# EAGLE schematic SwimWatch2.1 (EAGLE 6.6.0)
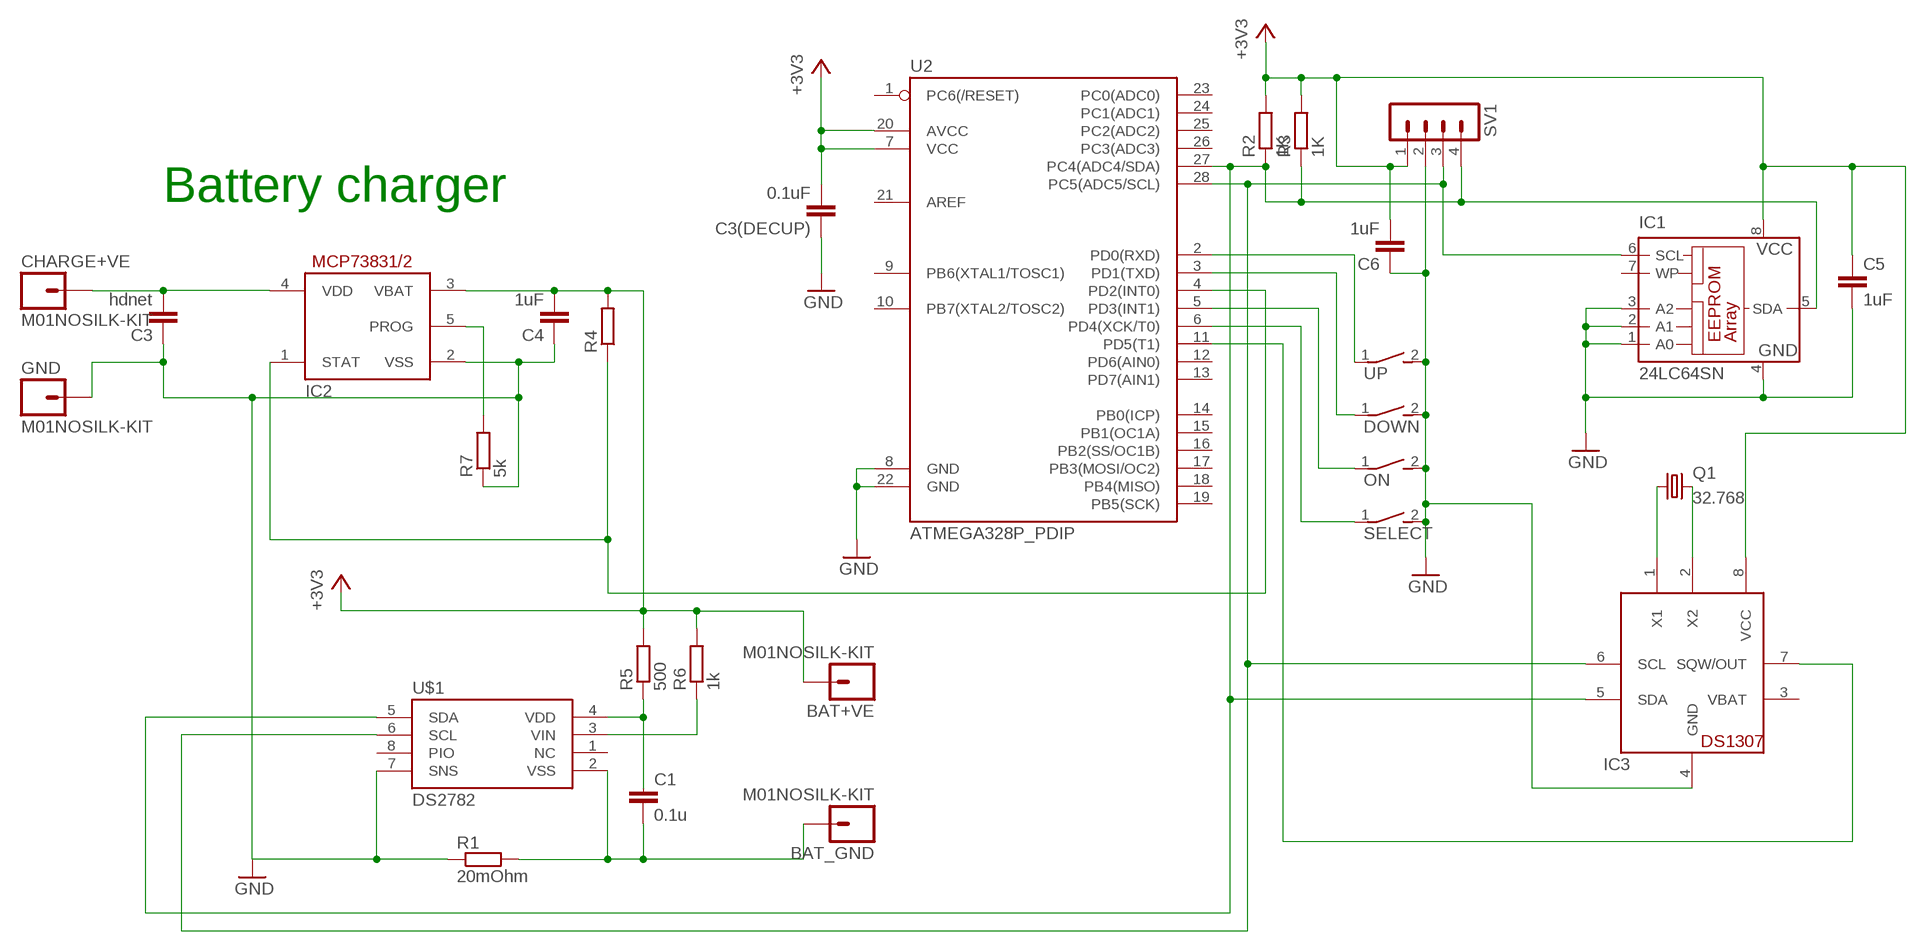
[diagram p0: schematic, sheet 1]

## Parts
BAT+VE  M01NOSILK-KIT  [1X01NS-KIT]
BAT_GND  M01NOSILK-KIT  [1X01NS-KIT]
C1  0.1u  C-EU025-030X050  [C025-030X050]
C3  hdnet  C-EUC0805  [C0805]
C3(DECUP)  0.1uF  C-EUC0805  [C0805]
C4  1uF  C-EUC0805  [C0805]
C5  1uF  C-EUC0805  [C0805]
C6  1uF  C-EUC0805  [C0805]
CHARGE+VE  M01NOSILK-KIT  [1X01NS-KIT]
DOWN  DS01E  [DS-01]
GND  M01NOSILK-KIT  [1X01NS-KIT]
IC1  24LC64SN  [SO-08]
IC2  MCP73831/OT  [SOT23-5L]
IC3  DS1307  [DIL08]
ON  DS01E  [DS-01]
Q1  32.768  CRYSTALHC18U-V  [HC18U-V]
R1  20mOhm  R-EU_0204/5  [0204/5]
R2  1K  R-EU_M0805  [M0805]
R3  1K  R-EU_M0805  [M0805]
R4  R-EU_0204/5  [0204/5]
R5  500  R-EU_0204/5  [0204/5]
R6  1k  R-EU_0204/5  [0204/5]
R7  5k  R-EU_0204/5  [0204/5]
SELECT  DS01E  [DS-01]
SV1  MA04-1  [MA04-1]
U2  ATMEGA328P_PDIP  [DIL28-3]
U$1  DS2782  [DS2782]
UP  DS01E  [DS-01]

## Nets
+3V3: BAT+VE.1 C3(DECUP).2 C4.2 C5.1 C6.2 IC1.8(VCC) IC2.3(VBAT) IC3.8(VCC) R2.2 R3.2 R4.2 R5.2 R6.2 SV1.1 U2.7(VCC) U2.20(AVCC)
DOWN: IC1.5(SDA) IC3.5(SDA) R2.1 R3.1 SV1.4 U2.27(PC4(ADC4/SDA)) U$1.5(SDA)
GND: C3(DECUP).1 C3.1 C4.1 C5.2 C6.1 DOWN.2 GND.1 IC1.1(A0) IC1.2(A1) IC1.3(A2) IC1.4(GND) IC2.2(VSS) IC3.4(GND) ON.2 R1.1 R7.1 SELECT.2 SV1.2 U2.8(GND) U2.22(GND) U$1.7(SNS) UP.2
N$1: IC2.1(STAT) R4.1 U2.4(PD2(INT0))
N$2: R5.1 U$1.4(VDD)
N$3: SELECT.1 U2.6(PD4(XCK/T0))
N$4: IC2.5(PROG) R7.2
N$5: ON.1 U2.5(PD3(INT1))
N$6: U2.2(PD0(RXD)) UP.1
N$7: IC3.1(X1) Q1.1
N$8: C3.2 CHARGE+VE.1 IC2.4(VDD)
N$9: IC3.2(X2) Q1.2
N$10: DOWN.1 U2.3(PD1(TXD))
N$11: BAT_GND.1 C1.2 R1.2 U$1.2(VSS)
N$12: R6.1 U$1.3(VIN)
N$14: IC3.7(SQW/OUT) U2.11(PD5(T1))
SCL: IC1.6(SCL) IC3.6(SCL) SV1.3 U2.28(PC5(ADC5/SCL)) U$1.6(SCL)
Unconnected: C1.1 IC1.7(WP) U2.1(PC6(/RESET)) U2.9(PB6(XTAL1/TOSC1)) U2.10(PB7(XTAL2/TOSC2)) U2.12(PD6(AIN0)) U2.13(PD7(AIN1)) U2.14(PB0(ICP)) U2.15(PB1(OC1A)) U2.16(PB2(SS/OC1B)) U2.17(PB3(MOSI/OC2)) U2.18(PB4(MISO)) U2.19(PB5(SCK)) U2.21(AREF) U2.23(PC0(ADC0)) U2.24(PC1(ADC1)) U2.25(PC2(ADC2)) U2.26(PC3(ADC3)) U$1.1(NC) U$1.8(PIO)

## Notes on the sheet
- Battery charger

## Power pins joined to a net without a drawn wire
VBAT: IC3.3(VBAT)

## Library data of the parts
BAT+VE BAT_GND CHARGE+VE GND = SparkFun-Connectors:M01: Header 1 Standard 1-pin 0.1" header. Use with straight break away headers (SKU : PRT-00116), right angle break away headers (PRT-00553), swiss pins (PRT-00743), machine pins (PRT-00117), and female headers (PRT-00115).
C1 C3 C3(DECUP) C4-C6 = rcl:C-EU: CAPACITOR, European symbol
DOWN ON SELECT UP = switch-dil:DS01E: DIL/CODE SWITCH; OC_FARNELL: unknown; OC_NEWARK: unknown
IC1 = microchip:24*: Serial EEPROM I2C; MF: MICROCHIP; MPN: 24LC64-I/SN; OC_FARNELL: 9758070; OC_NEWARK: 12C2020
IC2 = adafruit:MCP73831: MCP73831/2 Miniature Single-Cell, Fully Integrated Li-Ion, Li-Polymer Charge Management Controllers. Nice and small simple lipoly charge controller, with adjustable current and status output (LED) http://www.ladyada.net/library/pcb/eaglelibrary.html
IC3 = adafruit:DS1307: DS1307 Real time clock (RTC) with battery backup ability. Talk to it via i2c
Q1 = crystal:CRYSTAL: CRYSTAL; OC_FARNELL: unknown; OC_NEWARK: unknown
R1-R7 = rcl:R-EU_: RESISTOR, European symbol
SV1 = con-lstb:MA04-1: PIN HEADER; OC_FARNELL: unknown; OC_NEWARK: unknown
U2 = SparkFun-DigitalIC:ATMEGA328P_PDIP: uC used in the Arduino 32kb flash, 1k EEPROM, 2k SRAM This is the through-hole version of this chip.
U$1 = Components:DS2782